# Altium schematic sheet Peripherals.SchDoc
size A3
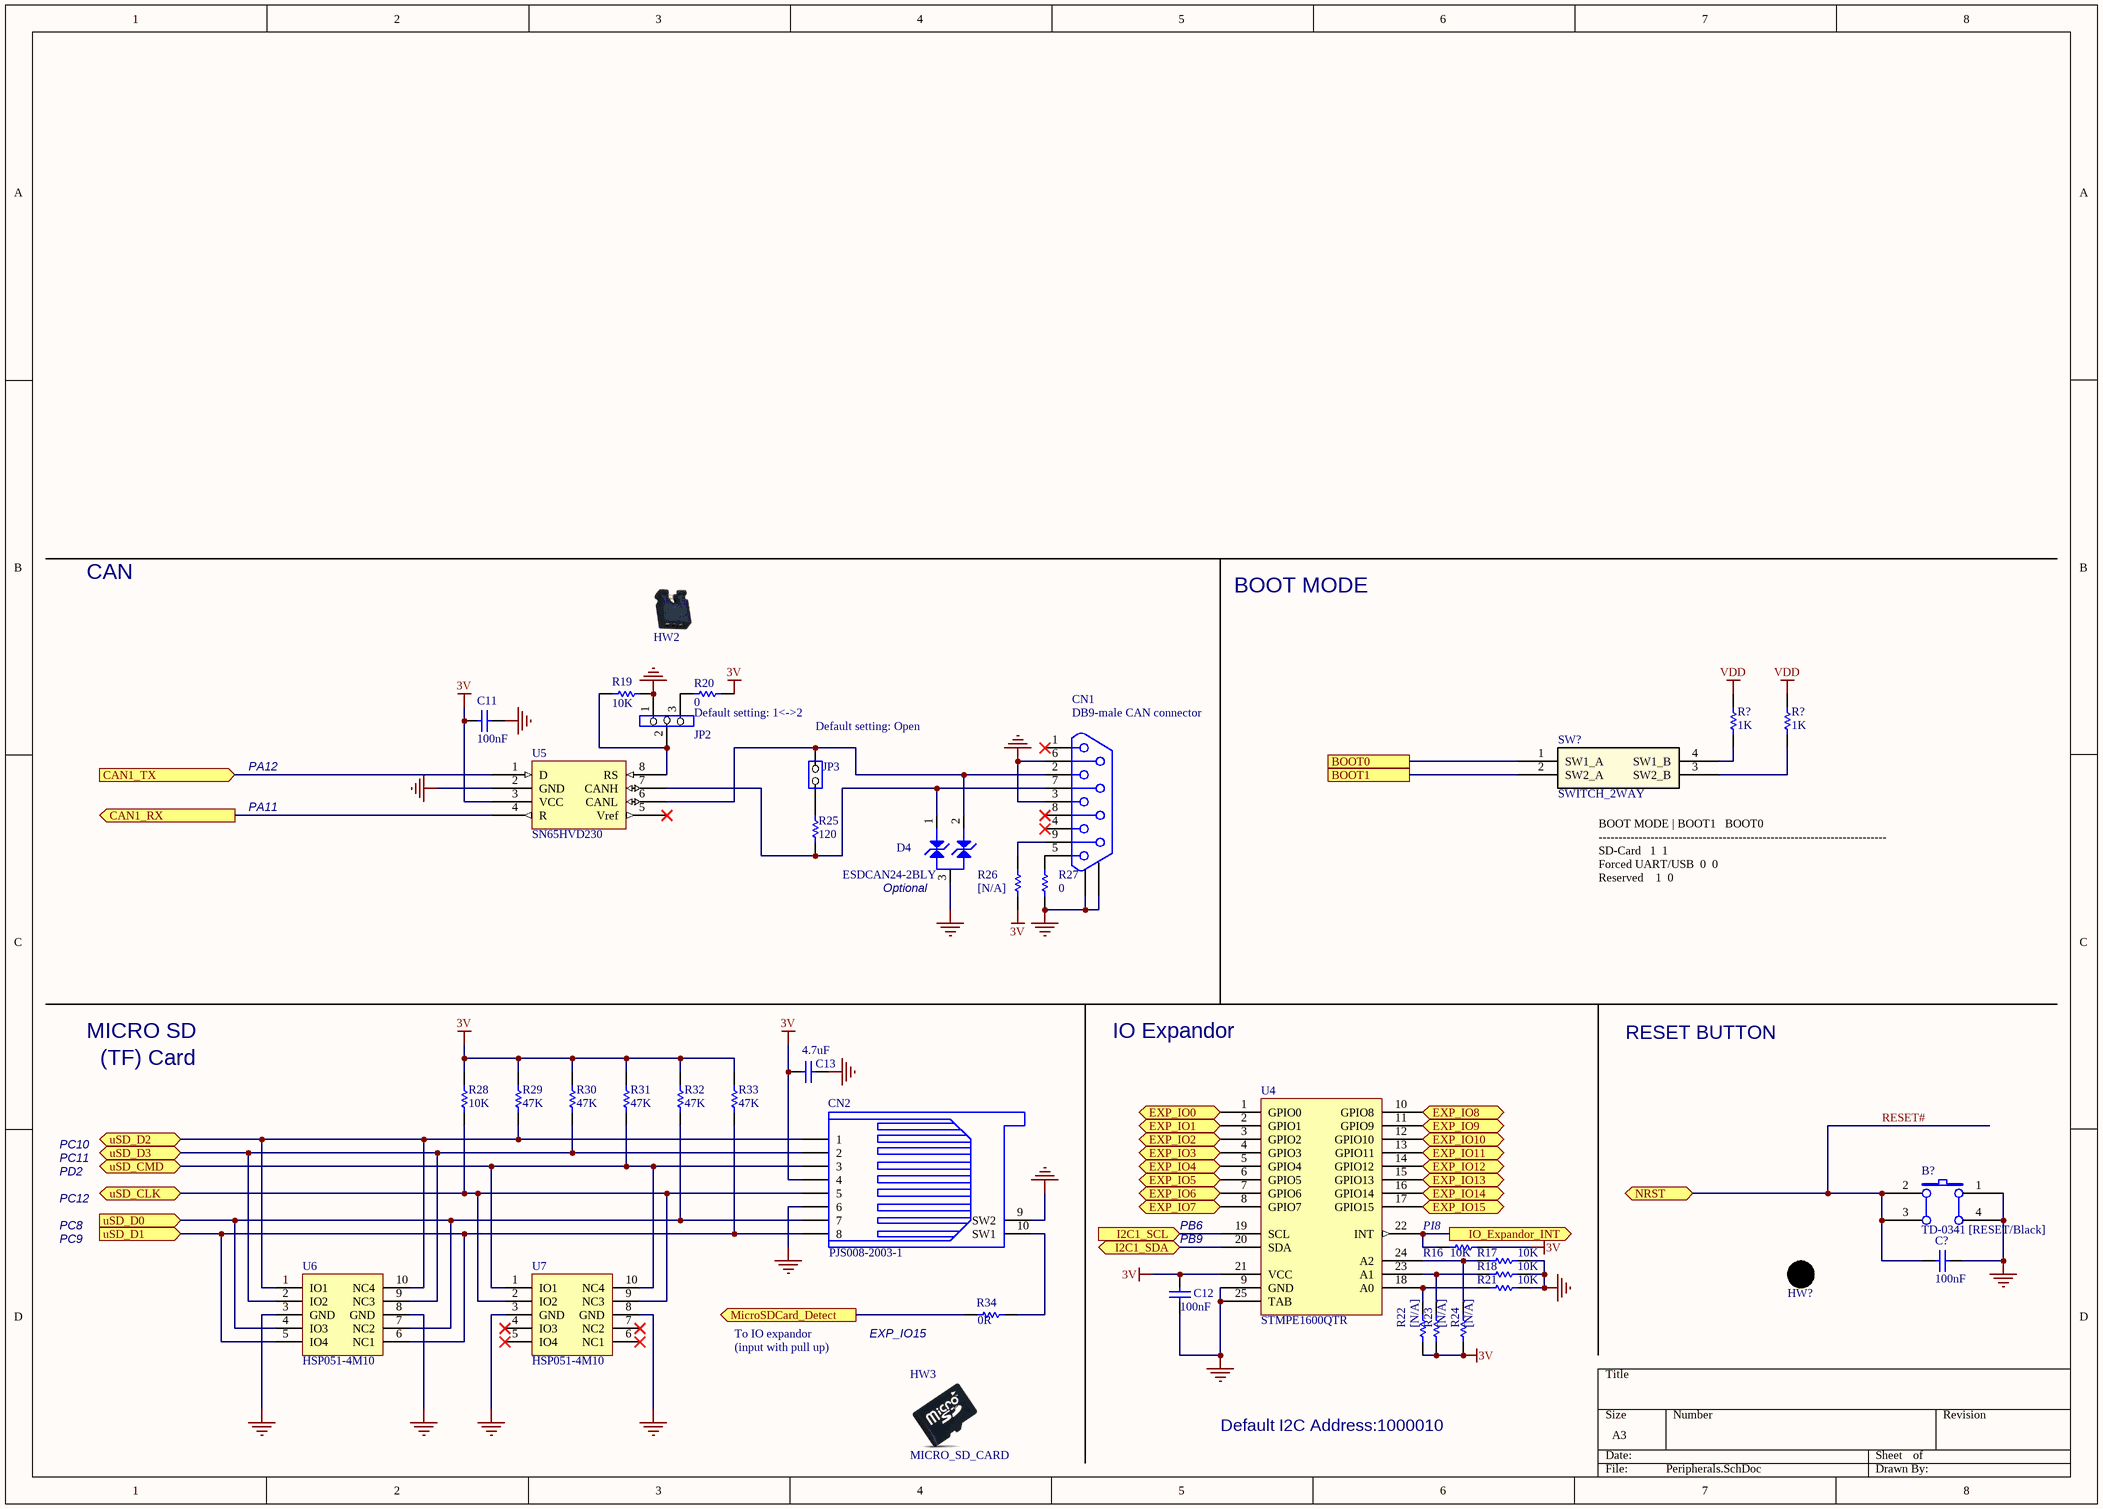
[diagram p0: Peripherals.SchDoc]

## Parts
(Parts that share a designator on the sheet are numbered #1, #2 ... from top to bottom, then left to right.)
B?  TD-0341 [RESET/Black]  [PB10]
C11  100nF  [0603C]
C12  100nF  [0603C]
C13  value 4.7uF  [C0402]  (hidden comment: Capacitor)
C?  100nF  [0603C]
CN1  DB9-male CAN connector  [DB9/M]
CN2  value PJS008-2003-1  [CON_MICROSD_YAMAICHI_PJS008-2003-0]
D4  ESDCAN24-2BLY  [SOT23-213]
HW2  JUMPER_OPEN  (value not drawn)
HW3  Micro_SD_card  (mechanical)
HW?  BUTTON_HAT_BLACK  (value not drawn)  (mechanical)
JP2  (no value)  [SIP3]
JP3  (no value)  [SIP2]
R16  10K  [0603R]
R17  10K  [0603R]
R18  10K  [0603R]
R19  10K  [0603R]
R20  0  [0603R]
R21  10K  [0603R]
R22  [N/A]  [0603R]
R23  [N/A]  [0603R]
R24  [N/A]  [0603R]
R25  120  [0603R]
R26  [N/A]  [0603R]
R27  0  [0603R]
R28  value 10K  [R0402]
R29  value 47K  [R0402]
R30  value 47K  [R0402]
R31  value 47K  [R0402]
R32  value 47K  [R0402]
R33  value 47K  [R0402]
R34  value 0R  [R0402]
R?#1  value 1K  [R0402]
R?#2  value 1K  [R0402]
SW?  SWITCH_2WAY  [SWI_C&K_SDA02H1SBD_2POS]
U4  STMPE1600QTR  [QFN24_0R5_4X4]
U5  SN65HVD230  [SOIC8_1R27_4R9X6]
U6  HSP051-4M10  [ESD_UQFN-10L_2P5X1_P050]
U7  HSP051-4M10  [ESD_UQFN-10L_2P5X1_P050]

## Ports
BOOT0, BOOT1, CAN1_RX (out), CAN1_TX (in), EXP_IO0 (bidir), EXP_IO1 (bidir), EXP_IO2 (bidir), EXP_IO3 (bidir), EXP_IO4 (bidir), EXP_IO5 (bidir), EXP_IO6 (bidir), EXP_IO7 (bidir), EXP_IO8 (bidir), EXP_IO9 (bidir), EXP_IO10 (bidir), EXP_IO11 (bidir), EXP_IO12 (bidir), EXP_IO13 (bidir), EXP_IO14 (bidir), EXP_IO15 (bidir), I2C1_SCL (in), I2C1_SDA (bidir), IO_Expandor_INT (out), MicroSDCard_Detect (out), NRST (bidir), uSD_CLK (bidir), uSD_CMD (bidir), uSD_D0 (in), uSD_D1 (in), uSD_D2 (bidir), uSD_D3 (bidir)

## Nets
3V: C11.1 C12.1 C13.2 CN2.4 R16.1 R20.2 R22.1 R23.1 R24.1 R26.1 R28.2 R29.2 R30.2 R31.2 R32.2 R33.2 U4.21(VCC) U5.3(VCC)
GND: B?.1(A0) B?.4(A1) C11.2 C12.2 C13.1 C?.1 CN1.3 CN1.6 CN1.10 CN1.11 CN2.6 CN2.9(SW2) D4.3 JP2.1 R17.1 R18.1 R19.2 R21.1 R27.1 U4.9(GND) U4.25(TAB) U5.2(GND) U6.3(GND) U6.8(GND) U7.3(GND) U7.8(GND)
VDD: R?#1.2 R?#2.2
BOOT0: SW?.1(SW1_A) ; port BOOT0
BOOT1: SW?.2(SW2_A) ; port BOOT1
CAN1_RX: U5.4(R) ; port CAN1_RX
CAN1_TX: U5.1(D) ; port CAN1_TX
EXP_IO0: U4.1(GPIO0) ; port EXP_IO0
EXP_IO1: U4.2(GPIO1) ; port EXP_IO1
EXP_IO2: U4.3(GPIO2) ; port EXP_IO2
EXP_IO3: U4.4(GPIO3) ; port EXP_IO3
EXP_IO4: U4.5(GPIO4) ; port EXP_IO4
EXP_IO5: U4.6(GPIO5) ; port EXP_IO5
EXP_IO6: U4.7(GPIO6) ; port EXP_IO6
EXP_IO7: U4.8(GPIO7) ; port EXP_IO7
EXP_IO8: U4.10(GPIO8) ; port EXP_IO8
EXP_IO9: U4.11(GPIO9) ; port EXP_IO9
EXP_IO10: U4.12(GPIO10) ; port EXP_IO10
EXP_IO11: U4.13(GPIO11) ; port EXP_IO11
EXP_IO12: U4.14(GPIO12) ; port EXP_IO12
EXP_IO13: U4.15(GPIO13) ; port EXP_IO13
EXP_IO14: U4.16(GPIO14) ; port EXP_IO14
EXP_IO15: U4.17(GPIO15) ; port EXP_IO15
I2C1_SCL: U4.19(SCL) ; port I2C1_SCL
I2C1_SDA: U4.20(SDA) ; port I2C1_SDA
IO_Expandor_INT: R16.2 U4.22(INT) ; port IO_Expandor_INT
MicroSDCard_Detect: R34.1 ; port MicroSDCard_Detect
RESET#: B?.2(B0) B?.3(B1) C?.2 ; port NRST
uSD_CLK: CN2.5 R28.1 U7.2(IO2) U7.9(NC3) ; port uSD_CLK
uSD_CMD: CN2.3 R31.1 U7.1(IO1) U7.10(NC4) ; port uSD_CMD
uSD_D0: CN2.7 R32.1 U6.4(IO3) U6.7(NC2) ; port uSD_D0
uSD_D1: CN2.8 R33.1 U6.5(IO4) U6.6(NC1) ; port uSD_D1
uSD_D2: CN2.1 R29.1 U6.1(IO1) U6.10(NC4) ; port uSD_D2
uSD_D3: CN2.2 R30.1 U6.2(IO2) U6.9(NC3) ; port uSD_D3
NetCN1_2: CN1.2 D4.2 JP3.2(NO) U5.6(CANL)
NetCN1_5: CN1.5 R27.2
NetCN1_7: CN1.7 D4.1 R25.1 U5.7(CANH)
NetCN1_9: CN1.9 R26.2
NetCN2_10: CN2.10(SW1) R34.2
NetJP2_2: JP2.2 R19.1 U5.8(RS)
NetJP2_3: JP2.3 R20.1
NetJP3_1: JP3.1(COMMON) R25.2
NetR17_2: R17.2 R24.2 U4.24(A2)
NetR18_2: R18.2 R23.2 U4.23(A1)
NetR21_2: R21.2 R22.2 U4.18(A0)
NetR?#1_1: R?#1.1 SW?.4(SW1_B)
NetR?#2_1: R?#2.1 SW?.3(SW2_B)

Not connected (* = marked no-connect by the designer): CN1 1* 4* 8*; U5 5(Vref)*; U7 4(IO3)* 5(IO4)* 6(NC1)* 7(NC2)*

## Notes on the sheet
- CAN
- BOOT MODE
- Default setting: 1<->2
- PA12
- (near JP3) Default setting: Open
- PA11
- (near D4) Optional
- (near SW?) BOOT MODE	|	BOOT1 		BOOT0
  ------------------------------------------------------------------------
  SD-Card			1		1
  Forced UART/USB		0		0
  Reserved 			1		0
- MICRO SD
- IO Expandor
- RESET BUTTON
- (TF) Card
- PC10
- PC11
- PD2
- PC8
- PC9
- PC12
- PB9
- PB6
- (near R16) PI8
- (input with pull up)
- To IO expandor
- EXP_IO15
- Default I2C Address:1000010

## Library data of the parts
B? = SW PUSHBUTTON: SE PUSHBUTTON
C11 C12 = Cap: Capacitor; Value: 10nF; Published: 8-Jun-2000; Revision: July-2002: Re-released for DXP Platform.; Publisher: Altium Limited
C13 = MCD-01356: Capacitor, MLCC, 4.7uF, 6V3, X5R, 20%, 0402, T=0,5mm; Manufacturer_Part_Number: GRM155R60J475ME47; Manufacturer: MURATA; Provided_By: SUBCO; Internal_Part_Number: MCD-01356; Status: Released; Part_Type: Capacitor; Package: C0402; ComponentLink1Description: Datasheet; ComponentLink1URL: http://tunmcdsvn.tun.st.com/Component_Datasheet_Library/Trunk/Capacitors/Murata_Capacitor_GR_series
C? = CAP: Capacitor; Value: 100pF; Published: 8-Jun-2000; Revision: July-2002: Re-released for DXP Platform.; Publisher: Altium Limited
CN1 = DB9-CAN
CN2 = MCD-00023: MicroSD Card Conn, Reversed-Type, Mnt Push-Push; Manufacturer: YAMAICHI; Part_Type: Connector; Provided_By: SUBCO; Initial_Board_Reference: mb1274; Internal_Part_Number: MCD-00023; Manufacturer_Part_Number: PJS008-2003-1; ComponentLink1Description: Datasheet; ECCN_US: n/a; ECCN_EU: n/a; Status: Released; ComponentLink1URL: http://tunmcdsvn.tun.st.com/Component_Datasheet_Library/Trunk/Connectors/Yamaichi_Connector_microSD-Card-PJS008-2003
HW3 = MCD-01200: MICRO_SD_CARD Standard min 4GB; Part_Type: Misc; Manufacturer: NETAC; Alternate_Manufacturer: Jiubaba; Alternate_Manufacturer_Part_Number: 988.05.20.3.00018; Provided_By: SUBCO; Initial_Board_Reference: MB1372; Internal_Part_Number: MCD-01200; Value: MICRO_SD_CARD; Status: Checked; Manufacturer_Part_Number: SD_CARD; ComponentLink1Description: Datasheet; ComponentLink1URL: http://na; ECCN_US: n/a; ECCN_EU: n/a
JP2 = Jumper3
JP3 = JP2
R16 R19 R22-R24 = Res1: Resistor; Value: 1K; Published: 8-Jun-2000; Revision: July-2002: Re-released for DXP Platform.; Publisher: Altium Limited
R17 R18 R20 R21 R25-R27 = res1: Resistor; Value: 1K; Published: 8-Jun-2000; Revision: July-2002: Re-released for DXP Platform.; Publisher: Altium Limited
R28 = MCD-00053: Resistor,10K,0402,1%,1/16W; Manufacturer_Part_Number: RC0402FR-0710KL; Manufacturer: YAGEO; Provided_By: SUBCO; Initial_Board_Reference: mb1274; Internal_Part_Number: MCD-00053; ComponentLink1Description: Datasheet; ECCN_US: n/a; ECCN_EU: n/a; Status: Released; Part_Type: Resistor; ComponentLink1URL: http://tunmcdsvn.tun.st.com/Component_Datasheet_Library/Trunk/Resistors/Yageo_Resistor_RC0402-series; Package: R0402
R29-R33 = MCD-00063: Resistor,47K,0402,1%,1/16W; Manufacturer_Part_Number: RC0402FR-0747KL; Manufacturer: YAGEO; Provided_By: SUBCO; Initial_Board_Reference: mb1274; Internal_Part_Number: MCD-00063; ComponentLink1Description: Datasheet; ECCN_US: n/a; ECCN_EU: n/a; Status: Released; Part_Type: Resistor; ComponentLink1URL: http://tunmcdsvn.tun.st.com/Component_Datasheet_Library/Trunk/Resistors/Yageo_Resistor_RC0402-series; Package: R0402
R34 = MCD-00052: Resistor,0R,0402,5%,1/16W; Manufacturer_Part_Number: RC0402JR-070RL; Manufacturer: YAGEO; Provided_By: SUBCO; Initial_Board_Reference: mb1274; Internal_Part_Number: MCD-00052; ComponentLink1Description: Datasheet; ECCN_US: n/a; ECCN_EU: n/a; Status: Released; Part_Type: Resistor; ComponentLink1URL: http://tunmcdsvn.tun.st.com/Component_Datasheet_Library/Trunk/Resistors/Yageo_Resistor_RC0402-series; Package: R0402
R?#1 R?#2 = MCD-00061: Resistor,1K,0402,1%,1/16W; Manufacturer_Part_Number: RC0402FR-071KL; Manufacturer: YAGEO; Provided_By: SUBCO; Initial_Board_Reference: mb1274; Internal_Part_Number: MCD-00061; ComponentLink1Description: Datasheet; ECCN_US: n/a; ECCN_EU: n/a; Status: Released; Part_Type: Resistor; ComponentLink1URL: http://tunmcdsvn.tun.st.com/Component_Datasheet_Library/Trunk/Resistors/Yageo_Resistor_RC0402-series; Package: R0402
SW? = MCD-00658: Dip Switch ,2Position ,Surface Mount Slide (Standard) ,2.54 pitch,25mA 24VDC; Part_Type: Misc; Manufacturer_Part_Number: SDA02H1SBD; Manufacturer: C&K; Provided_By: SUBCO; Initial_Board_Reference: MB1272; Internal_Part_Number: MCD-00658; Value: SWITCH_2WAY; Status: Footprint available; Package: DIP; ComponentLink1Description: Datasheet; ComponentLink1URL: http://tunmcdsvn.tun.st.com/Component_Datasheet_Library/Trunk/Misc/CK_switch_dip_sda_series; ECCN_US: n/a; ECCN_EU: n/a
U4 = STMPE1600
U5 = SN65HVD230D
U6 U7 = MCD-00667: 4-line ESD protection for high speed lines; Part_Type: Diode; Manufacturer: STMICROELECTRONICS; BMS_Part_Number: 9179041; ECCN_US: EAR99; ECCN_EU: NEC; Provided_By: SUBCO with ST control; Initial_Board_Reference: MB1331; Internal_Part_Number: MCD-00667; Value: HSP051-4M10; Status: Checked; Manufacturer_Part_Number: HSP051-4M10; Package: uQFN-10L; ComponentLink1Description: Datasheet; ComponentLink1URL: http://tunmcdsvn.tun.st.com/Component_Datasheet_Library/Trunk/Diodes/STM_ESD_HSP051-4M10